# Altium schematic sheet button.SchDoc
size A4
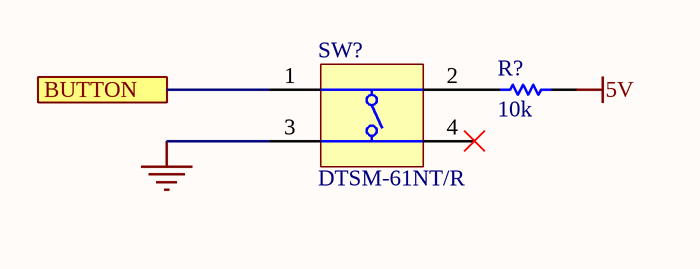
[diagram p0: button.SchDoc]

## Parts
R?  10k  [RESC0805(2012)_L]
SW?  DTSM-61NT/R  [DIPT-DTSM-6_V]

## Ports
BUTTON

## Nets
5V: R?.2
GND: SW?.3(T3)
BUTTON: SW?.1(T1) ; port BUTTON
NetR?_1: R?.1 SW?.2(T2)

Not connected (* = marked no-connect by the designer): SW? 4(T3)*

## Library data of the parts
R? = CMP-1013-00397-1: Value: 100.00 Ohm; Power: 0.125 W; Case-Metric: 2012; Case-EIA: 0805; Tolerance: 1 %; Technology: SMT
SW? = CMP-0306-00001-1: Switch, SPNO Push Button SMD; Manufacturer: Diptronics; Packing Type: Tape&Reel; Mechanical Life: 200,000 cycles; ComponentLink2URL: http://www.dip.com.tw/Products_tact.htm; ComponentLink1URL: http://www.dip.com.tw/; ComponentLink3URL: http://www.dip.com.tw/PDF/pro_tact/DTSM_G_-6_2_-V.pdf; PackageDescription: Switch, Through-Hole, 4 Leads, Body 8.5x8.5mm, Row Spacing 9.0mm, Pitch 4.5mm; ComponentLink2Description: Datasheet; ComponentLink3Description: Package Specification; ComponentLink1Description: Manufacturer URL; PackageReference: DTSM-6; PartNumber: DTSM-61NT/R; Mounting Technology: Through Hole